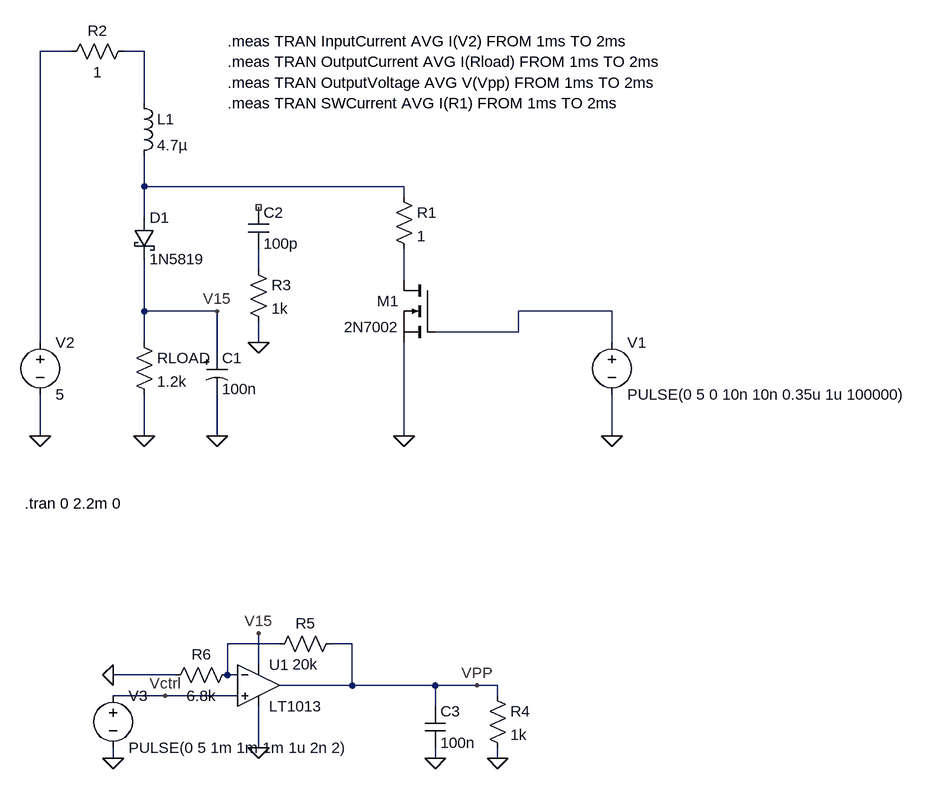
[diagram p0: schematic SimpleBoost_V5_opamp.asc]
SimpleBoost_V5_opamp.asc, the LTspice schematic file:
Version 4
SHEET 1 1400 1108
WIRE -128 0 -176 0
WIRE -16 0 -48 0
WIRE -16 80 -16 0
WIRE -16 208 -16 160
WIRE 384 208 -16 208
WIRE 384 224 384 208
WIRE -16 256 -16 208
WIRE 160 336 160 304
WIRE 384 352 384 304
WIRE -16 400 -16 320
WIRE 96 400 -16 400
WIRE 704 400 560 400
WIRE 560 432 560 400
WIRE 560 432 432 432
WIRE -176 448 -176 0
WIRE -16 448 -16 400
WIRE 160 448 160 416
WIRE 704 448 704 400
WIRE 96 464 96 400
WIRE -176 592 -176 528
WIRE -16 592 -16 528
WIRE 96 592 96 528
WIRE 384 592 384 448
WIRE 704 592 704 528
WIRE 192 912 112 912
WIRE 304 912 272 912
WIRE 160 944 160 896
WIRE 32 960 -64 960
WIRE 112 960 112 912
WIRE 128 960 112 960
WIRE 304 976 304 912
WIRE 304 976 192 976
WIRE 432 976 304 976
WIRE 496 976 432 976
WIRE 528 976 496 976
WIRE 16 992 -64 992
WIRE 128 992 16 992
WIRE 528 992 528 976
WIRE 432 1008 432 976
WIRE 160 1072 160 1008
WIRE -64 1088 -64 1072
WIRE 432 1088 432 1072
WIRE 528 1088 528 1072
FLAG 96 592 0
FLAG -16 592 0
FLAG 384 592 0
FLAG 704 592 0
FLAG -176 592 0
FLAG 96 400 V15
FLAG 160 448 0
FLAG 160 896 V15
FLAG 160 1072 0
FLAG 528 1088 0
FLAG 432 1088 0
FLAG -64 1088 0
FLAG -64 960 0
FLAG 16 992 Vctrl
FLAG 496 976 VPP
SYMBOL ind -32 64 R0
SYMATTR InstName L1
SYMATTR Value 4.7µ
SYMATTR SpiceLine Ipk=0.75 Rser=0.48 Rpar=0 Cpar=0
SYMBOL schottky -32 256 R0
SYMATTR InstName D1
SYMATTR Value 1N5819
SYMATTR Description Diode
SYMATTR Type diode
SYMBOL res -32 432 R0
SYMATTR InstName RLOAD
SYMATTR Value 1.2k
SYMBOL polcap 80 464 R0
WINDOW 3 24 56 Left 2
SYMATTR Value 100n
SYMATTR InstName C1
SYMATTR Description Capacitor
SYMATTR Type cap
SYMATTR SpiceLine V=25 Irms=400m Rser=0.2 Lser=0
SYMBOL voltage 704 432 R0
WINDOW 123 0 0 Left 0
WINDOW 39 0 0 Left 0
SYMATTR InstName V1
SYMATTR Value PULSE(0 5 0 10n 10n 0.35u 1u 100000)
SYMBOL voltage -176 432 R0
WINDOW 123 0 0 Left 0
WINDOW 39 24 124 Left 2
SYMATTR InstName V2
SYMATTR Value 5
SYMBOL nmos 432 352 M0
SYMATTR InstName M1
SYMATTR Value 2N7002
SYMBOL res 368 208 R0
SYMATTR InstName R1
SYMATTR Value 1
SYMBOL cap 144 240 R0
SYMATTR InstName C2
SYMATTR Value 100p
SYMBOL res -32 -16 R90
WINDOW 0 0 56 VBottom 2
WINDOW 3 32 56 VTop 2
SYMATTR InstName R2
SYMATTR Value 1
SYMBOL res 144 320 R0
SYMATTR InstName R3
SYMATTR Value 1k
SYMBOL Opamps\\LT1013 160 912 R0
SYMATTR InstName U1
SYMBOL cap 416 1008 R0
SYMATTR InstName C3
SYMATTR Value 100n
SYMBOL res 512 976 R0
SYMATTR InstName R4
SYMATTR Value 1k
SYMBOL res 288 896 R90
WINDOW 0 0 56 VBottom 2
WINDOW 3 32 56 VTop 2
SYMATTR InstName R5
SYMATTR Value 20k
SYMBOL res 128 944 R90
WINDOW 0 0 56 VBottom 2
WINDOW 3 32 56 VTop 2
SYMATTR InstName R6
SYMATTR Value 6.8k
SYMBOL voltage -64 976 R0
WINDOW 123 0 0 Left 0
WINDOW 39 0 0 Left 0
SYMATTR InstName V3
SYMATTR Value PULSE(0 5 1m 1m 1m 1u 2n 2)
TEXT -200 696 Left 2 !.tran 0 2.2m 0
TEXT 112 -16 Left 2 !.meas TRAN InputCurrent AVG I(V2) FROM 1ms TO 2ms
TEXT 112 16 Left 2 !.meas TRAN OutputCurrent AVG I(Rload) FROM 1ms TO 2ms
TEXT 112 48 Left 2 !.meas TRAN OutputVoltage AVG V(Vpp) FROM 1ms TO 2ms
TEXT 112 80 Left 2 !.meas TRAN SWCurrent AVG I(R1) FROM 1ms TO 2ms

The netlist it stands for:
* SimpleBoost_V5_opamp.asc
L1 N002 N003 4.7µ Ipk=0.75 Rser=0.48 Rpar=0 Cpar=0
D1 N003 V15 1N5819
RLOAD V15 0 1.2k
C1 V15 0 100n V=25 Irms=400m Rser=0.2 Lser=0
V1 N006 0 PULSE(0 5 0 10n 10n 0.35u 1u 100000)
V2 N001 0 5
M1 N005 N006 0 0 2N7002
R1 N003 N005 1
C2 NC_01 N004 100p
R2 N002 N001 1
R3 N004 0 1k
XU1 Vctrl N007 V15 0 VPP LT1013  ; pins In+ In- V+ V- OUT
C3 VPP 0 100n
R4 VPP 0 1k
R5 VPP N007 20k
R6 N007 0 6.8k
V3 Vctrl 0 PULSE(0 5 1m 1m 1m 1u 2n 2)
.model D D
.lib standard.dio
.model NMOS NMOS
.model PMOS PMOS
.lib standard.mos
.tran 0 2.2m 0
.meas TRAN InputCurrent AVG I(V2) FROM 1ms TO 2ms
.meas TRAN OutputCurrent AVG I(Rload) FROM 1ms TO 2ms
.meas TRAN OutputVoltage AVG V(Vpp) FROM 1ms TO 2ms
.meas TRAN SWCurrent AVG I(R1) FROM 1ms TO 2ms
.lib LTC.lib
.backanno
.end